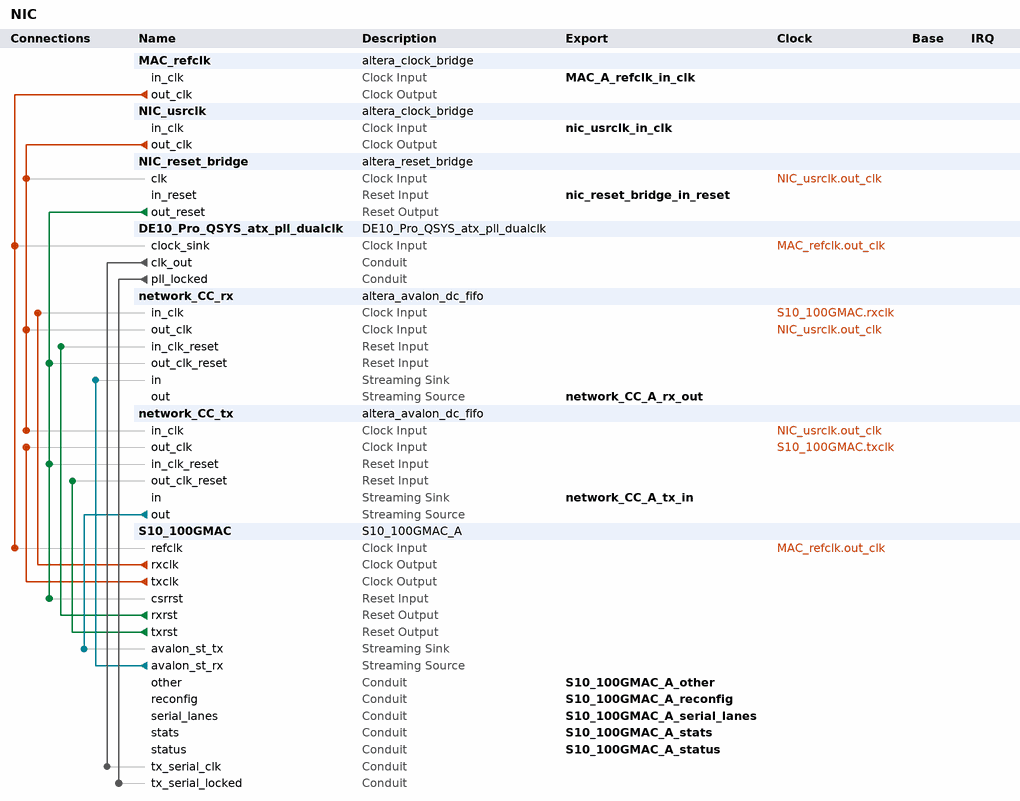
[diagram p0: system contents]
# Platform Designer (Qsys) system NIC, Stratix 10 1SX280HU2F50E1VG
# Parameters at their usual value, and those the tool derives, are not listed.
package require -exact qsys 1.0
create_system NIC
set_project_property DEVICE_FAMILY {Stratix 10}
set_project_property DEVICE 1SX280HU2F50E1VG

add_component MAC_refclk ip/DE10_Pro_QSYS/DE10_Pro_QSYS_clock_bridge_MAC.ip altera_clock_bridge MAC_refclk 19.1

add_component NIC_usrclk ip/NIC/NIC_usrclk.ip altera_clock_bridge NIC_usrclk 19.1
load_component NIC_usrclk
set_component_parameter_value DERIVED_CLOCK_RATE 100000000
set_component_parameter_value EXPLICIT_CLOCK_RATE 0
save_component

add_component NIC_reset_bridge ip/NIC/NIC_reset_bridge.ip altera_reset_bridge NIC_reset_bridge 19.1
load_component NIC_reset_bridge
set_component_parameter_value ACTIVE_LOW_RESET 0
set_component_parameter_value SYNCHRONOUS_EDGES deassert
set_component_parameter_value SYNC_RESET 0
save_component

add_component DE10_Pro_QSYS_atx_pll_dualclk {} DE10_Pro_QSYS_atx_pll_dualclk DE10_Pro_QSYS_atx_pll_dualclk 1.0

add_component network_CC_rx ip/DE10_Pro_QSYS/DE10_Pro_QSYS_network_CC.ip altera_avalon_dc_fifo network_CC_rx 19.1

add_component network_CC_tx ip/DE10_Pro_QSYS/DE10_Pro_QSYS_network_CC.ip altera_avalon_dc_fifo network_CC_tx 19.1

add_component S10_100GMAC {} S10_100GMAC_A S10_100GMAC 19.1.1

# connections
add_connection MAC_refclk.out_clk DE10_Pro_QSYS_atx_pll_dualclk.clock_sink clock
add_connection MAC_refclk.out_clk S10_100GMAC.refclk clock
add_connection NIC_usrclk.out_clk network_CC_rx.out_clk clock
add_connection NIC_usrclk.out_clk network_CC_tx.in_clk clock
add_connection NIC_usrclk.out_clk NIC_reset_bridge.clk clock
add_connection S10_100GMAC.rxclk network_CC_rx.in_clk clock
add_connection S10_100GMAC.txclk network_CC_tx.out_clk clock
add_connection NIC_reset_bridge.out_reset network_CC_rx.out_clk_reset reset
add_connection NIC_reset_bridge.out_reset network_CC_tx.in_clk_reset reset
add_connection NIC_reset_bridge.out_reset S10_100GMAC.csrrst reset
add_connection S10_100GMAC.rxrst network_CC_rx.in_clk_reset reset
add_connection S10_100GMAC.txrst network_CC_tx.out_clk_reset reset
add_connection network_CC_tx.out S10_100GMAC.avalon_st_tx avalon_streaming
add_connection S10_100GMAC.avalon_st_rx network_CC_rx.in avalon_streaming
add_connection DE10_Pro_QSYS_atx_pll_dualclk.clk_out S10_100GMAC.tx_serial_clk conduit
add_connection DE10_Pro_QSYS_atx_pll_dualclk.pll_locked S10_100GMAC.tx_serial_locked conduit

# exported interfaces
add_interface MAC_A_refclk_in_clk clock sink
set_interface_property MAC_A_refclk_in_clk EXPORT_OF MAC_refclk.in_clk
add_interface S10_100GMAC_A_other conduit end
set_interface_property S10_100GMAC_A_other EXPORT_OF S10_100GMAC.other
add_interface S10_100GMAC_A_reconfig conduit end
set_interface_property S10_100GMAC_A_reconfig EXPORT_OF S10_100GMAC.reconfig
add_interface S10_100GMAC_A_serial_lanes conduit end
set_interface_property S10_100GMAC_A_serial_lanes EXPORT_OF S10_100GMAC.serial_lanes
add_interface S10_100GMAC_A_stats conduit end
set_interface_property S10_100GMAC_A_stats EXPORT_OF S10_100GMAC.stats
add_interface S10_100GMAC_A_status conduit end
set_interface_property S10_100GMAC_A_status EXPORT_OF S10_100GMAC.status
add_interface network_CC_A_rx_out avalon_streaming source
set_interface_property network_CC_A_rx_out EXPORT_OF network_CC_rx.out
add_interface network_CC_A_tx_in avalon_streaming sink
set_interface_property network_CC_A_tx_in EXPORT_OF network_CC_tx.in
add_interface nic_reset_bridge_in_reset reset sink
set_interface_property nic_reset_bridge_in_reset EXPORT_OF NIC_reset_bridge.in_reset
add_interface nic_usrclk_in_clk clock sink
set_interface_property nic_usrclk_in_clk EXPORT_OF NIC_usrclk.in_clk

save_system NIC.qsys
